# EasyEDA Pro project MainPCB.epro

# Schematic Line_Follower
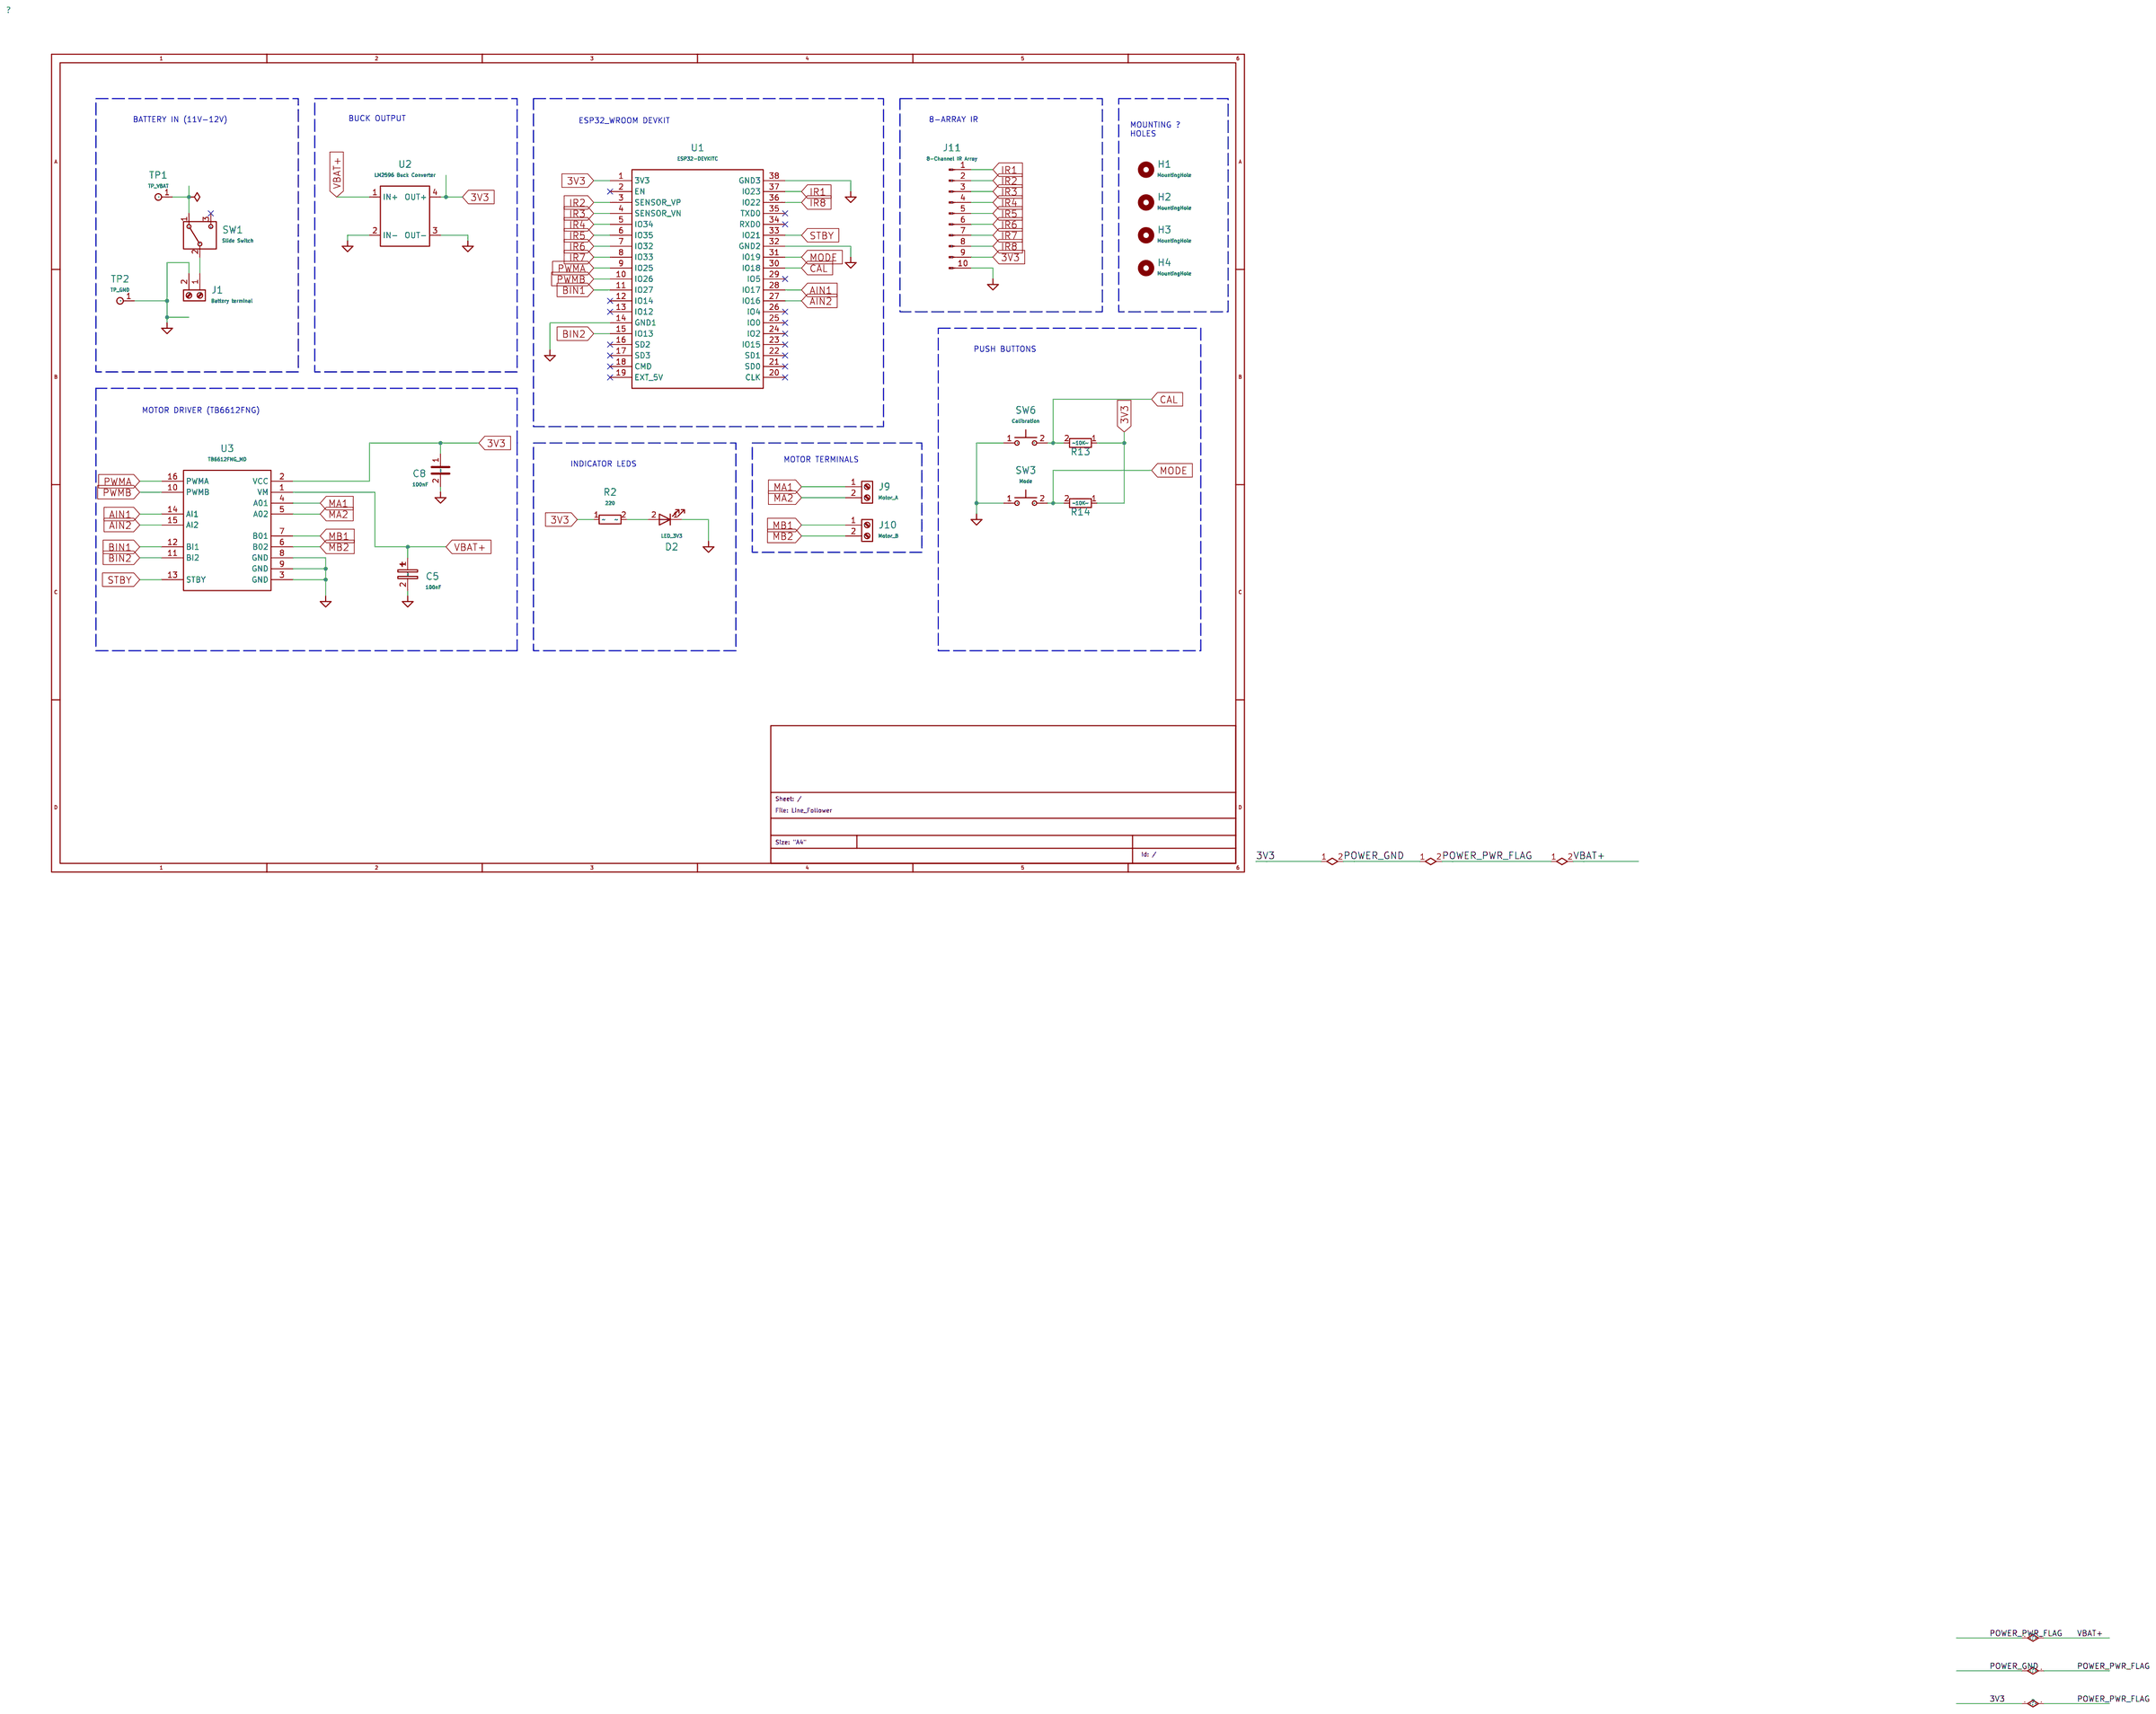
[diagram p0: schematic sheet]

## Parts
C5  100nF  [Capacitors:C320C]
C8  100nF  [Capacitors:C320C]
D2  LED_3V3  [LED_THT:LED_D5.0mm]
H1  MountingHole  [MountingHole:MountingHole_3.2mm_M3]
H2  MountingHole  [MountingHole:MountingHole_3.2mm_M3]
H3  MountingHole  [MountingHole:MountingHole_3.2mm_M3]
H4  MountingHole  [MountingHole:MountingHole_3.2mm_M3]
J1  Battery terminal  [Screw Terminal:CUI_TB007-508-02BE]
J9  Motor_A  [Screw Terminal:CUI_TB007-508-02BE]
J10  Motor_B  [Screw Terminal:CUI_TB007-508-02BE]
J11  8-Channel IR Array  [Connector_PinHeader_2.54mm:PinHeader_1x10_P2.54mm_Vertical]
R2  220  [Resistor_THT:R_Axial_DIN0207_L6.3mm_D2.5mm_P10.16mm_Horizontal]
R13  10K  [Resistor_THT:R_Axial_DIN0207_L6.3mm_D2.5mm_P10.16mm_Horizontal]
R14  10K  [Resistor_THT:R_Axial_DIN0207_L6.3mm_D2.5mm_P10.16mm_Horizontal]
SW1  Slide Switch  [Button_Switch_THT:SW_Slide-03_Wuerth-WS-SLTV_10x2.5x6.4_P2.54mm]
SW3  Mode  [Button_Switch_THT:SW_PUSH_6mm]
SW6  Calibration  [Button_Switch_THT:SW_PUSH_6mm]
TP1  TP_VBAT  [TestPoint:TestPoint_Pad_2.0x2.0mm]
TP2  TP_GND  [TestPoint:TestPoint_Pad_2.0x2.0mm]
U1  ESP32-DEVKITC  [ESP-WROOM:MODULE_ESP32-DEVKITC]
U2  LM2596 Buck Converter  [Buck_Converter:LM2596_Buck_Module]
U3  TB6612FNG_MD  [TB6612FNG:TB6612FNG_Driver]

## Library data of the parts
C5 = Device_C_Polarized: Polarized capacitor
C8 = Device_C: Unpolarized capacitor
D2 = Device_LED: Light emitting diode; Sim_Pins: 1=K 2=A; Sim.Pins: 1=K 2=A
H1-H3 = Mechanical_MountingHole: Mounting Hole without connection; Attribute1: H4
H4 = Mechanical_MountingHole: Mounting Hole without connection
J1 J9 J10 = Connector_Screw_Terminal_01x02: Generic screw terminal, single row, 01x02, script generated (kicad-library-utils/schlib/autogen/connector/)
J11 = Connector_Conn_01x10_Pin: Generic connector, single row, 01x10, script generated
R2 R13 = Device_R: Resistor; Attribute1: R14
R14 = Device_R: Resistor
SW1 = Switch_SW_SPDT: Switch, single pole double throw
SW3 = Switch_SW_Push: Push button switch, generic, two pins
SW6 = Switch_SW_Push: Push button switch, generic, two pins; Attribute1: SW3
TP1 = Connector_TestPoint: test point; Attribute1: TP2
TP2 = Connector_TestPoint: test point
U1 = ESP32-DEVKITC_ESP32-DEVKITC: MF: Espressif Systems; Description_1: Transceiver; 802.11 b/g/n (Wi-Fi, WiFi, WLAN), Bluetooth- Smart Ready 4.x Dual Mode; Package1: None; Price: None; Check_prices: https://www.snapeda.com/parts/ESP32-DEVKITC-32D-F/Espressif+Systems/view-part/?ref=eda; STANDARD: Manufacturer Recommendations; PARTREV: N/A; SnapEDA_Link: https://www.snapeda.com/parts/ESP32-DEVKITC-32D-F/Espressif+Systems/view-part/?ref=snap; MP: ESP32-DEVKITC-32D-F; Availability: In Stock; MANUFACTURER: ESPRESSIF
U2 = buck_converter_LM2596_Module
U3 = TB6612FNG_TB6612FNG_MD

## Nets
AIN1: U1.28(IO17) U3.14(AI1)
AIN2: U1.27(IO16) U3.15(AI2)
BIN1: U1.11(IO27) U3.12(BI1)
BIN2: U1.15(IO13) U3.11(BI2)
CAL: R13.2 SW6.2 U1.30(IO18)
IR1: J11.1(Pin) U1.37(IO23)
IR2: J11.2(Pin) U1.3(SENSOR_VP)
IR3: J11.3(Pin) U1.4(SENSOR_VN)
IR4: J11.4(Pin) U1.5(IO34)
IR5: J11.5(Pin) U1.6(IO35)
IR6: J11.6(Pin) U1.7(IO32)
IR7: J11.7(Pin) U1.8(IO33)
IR8: J11.8(Pin) U1.36(IO22)
MA1: J9.1(Pin) U3.4(A01)
MA2: J9.2(Pin) U3.5(A02)
MB1: J10.1(Pin) U3.7(B01)
MB2: J10.2(Pin) U3.6(B02)
MODE: R14.2 SW3.2 U1.31(IO19)
POWER_GND: C5.1 C5.2 C8.1 C8.2 D2.1(K) J1.2(Pin) J11.9(Pin) J11.10(Pin) R2.1 R13.1 R14.1 SW1.1(A) SW3.1 SW6.1 TP1.1 TP2.1 U1.1(3V3) U1.14(GND1) U1.32(GND2) U1.38(GND3) U2.1(IN+) U2.2(IN-) U2.3(OUT-) U2.4(OUT+) U3.1(VM) U3.2(VCC) U3.3(GND) U3.8(GND) U3.9(GND)
PWMA: U1.9(IO25) U3.16(PWMA)
PWMB: U1.10(IO26) U3.10(PWMB)
STBY: U1.33(IO21) U3.13(STBY)
NET-(D2-A): D2.2(A) R2.2
NET-(J1-PIN_1): J1.1(Pin) SW1.2(B)

Not connected (* = marked no-connect by the designer): SW1 3(C)*; U1 2(EN)* 12(IO14)* 13(IO12)* 16(SD2)* 17(SD3)* 18(CMD)* 19(EXT_5V)* 20(CLK)* 21(SD0)* 22(SD1)* 23(IO15)* 24(IO2)* 25(IO0)* 26(IO4)* 29(IO5)* 34(RXD0)* 35(TXD0)*

## Notes on the sheet
- BATTERY IN (11V-12V)
- BUCK OUTPUT
- ESP32_WROOM DEVKIT
- 8-ARRAY IR
- MOUNTING
  HOLES
- PUSH BUTTONS
- MOTOR DRIVER (TB6612FNG)
- MOTOR TERMINALS
- INDICATOR LEDS

# Board Line_Follower
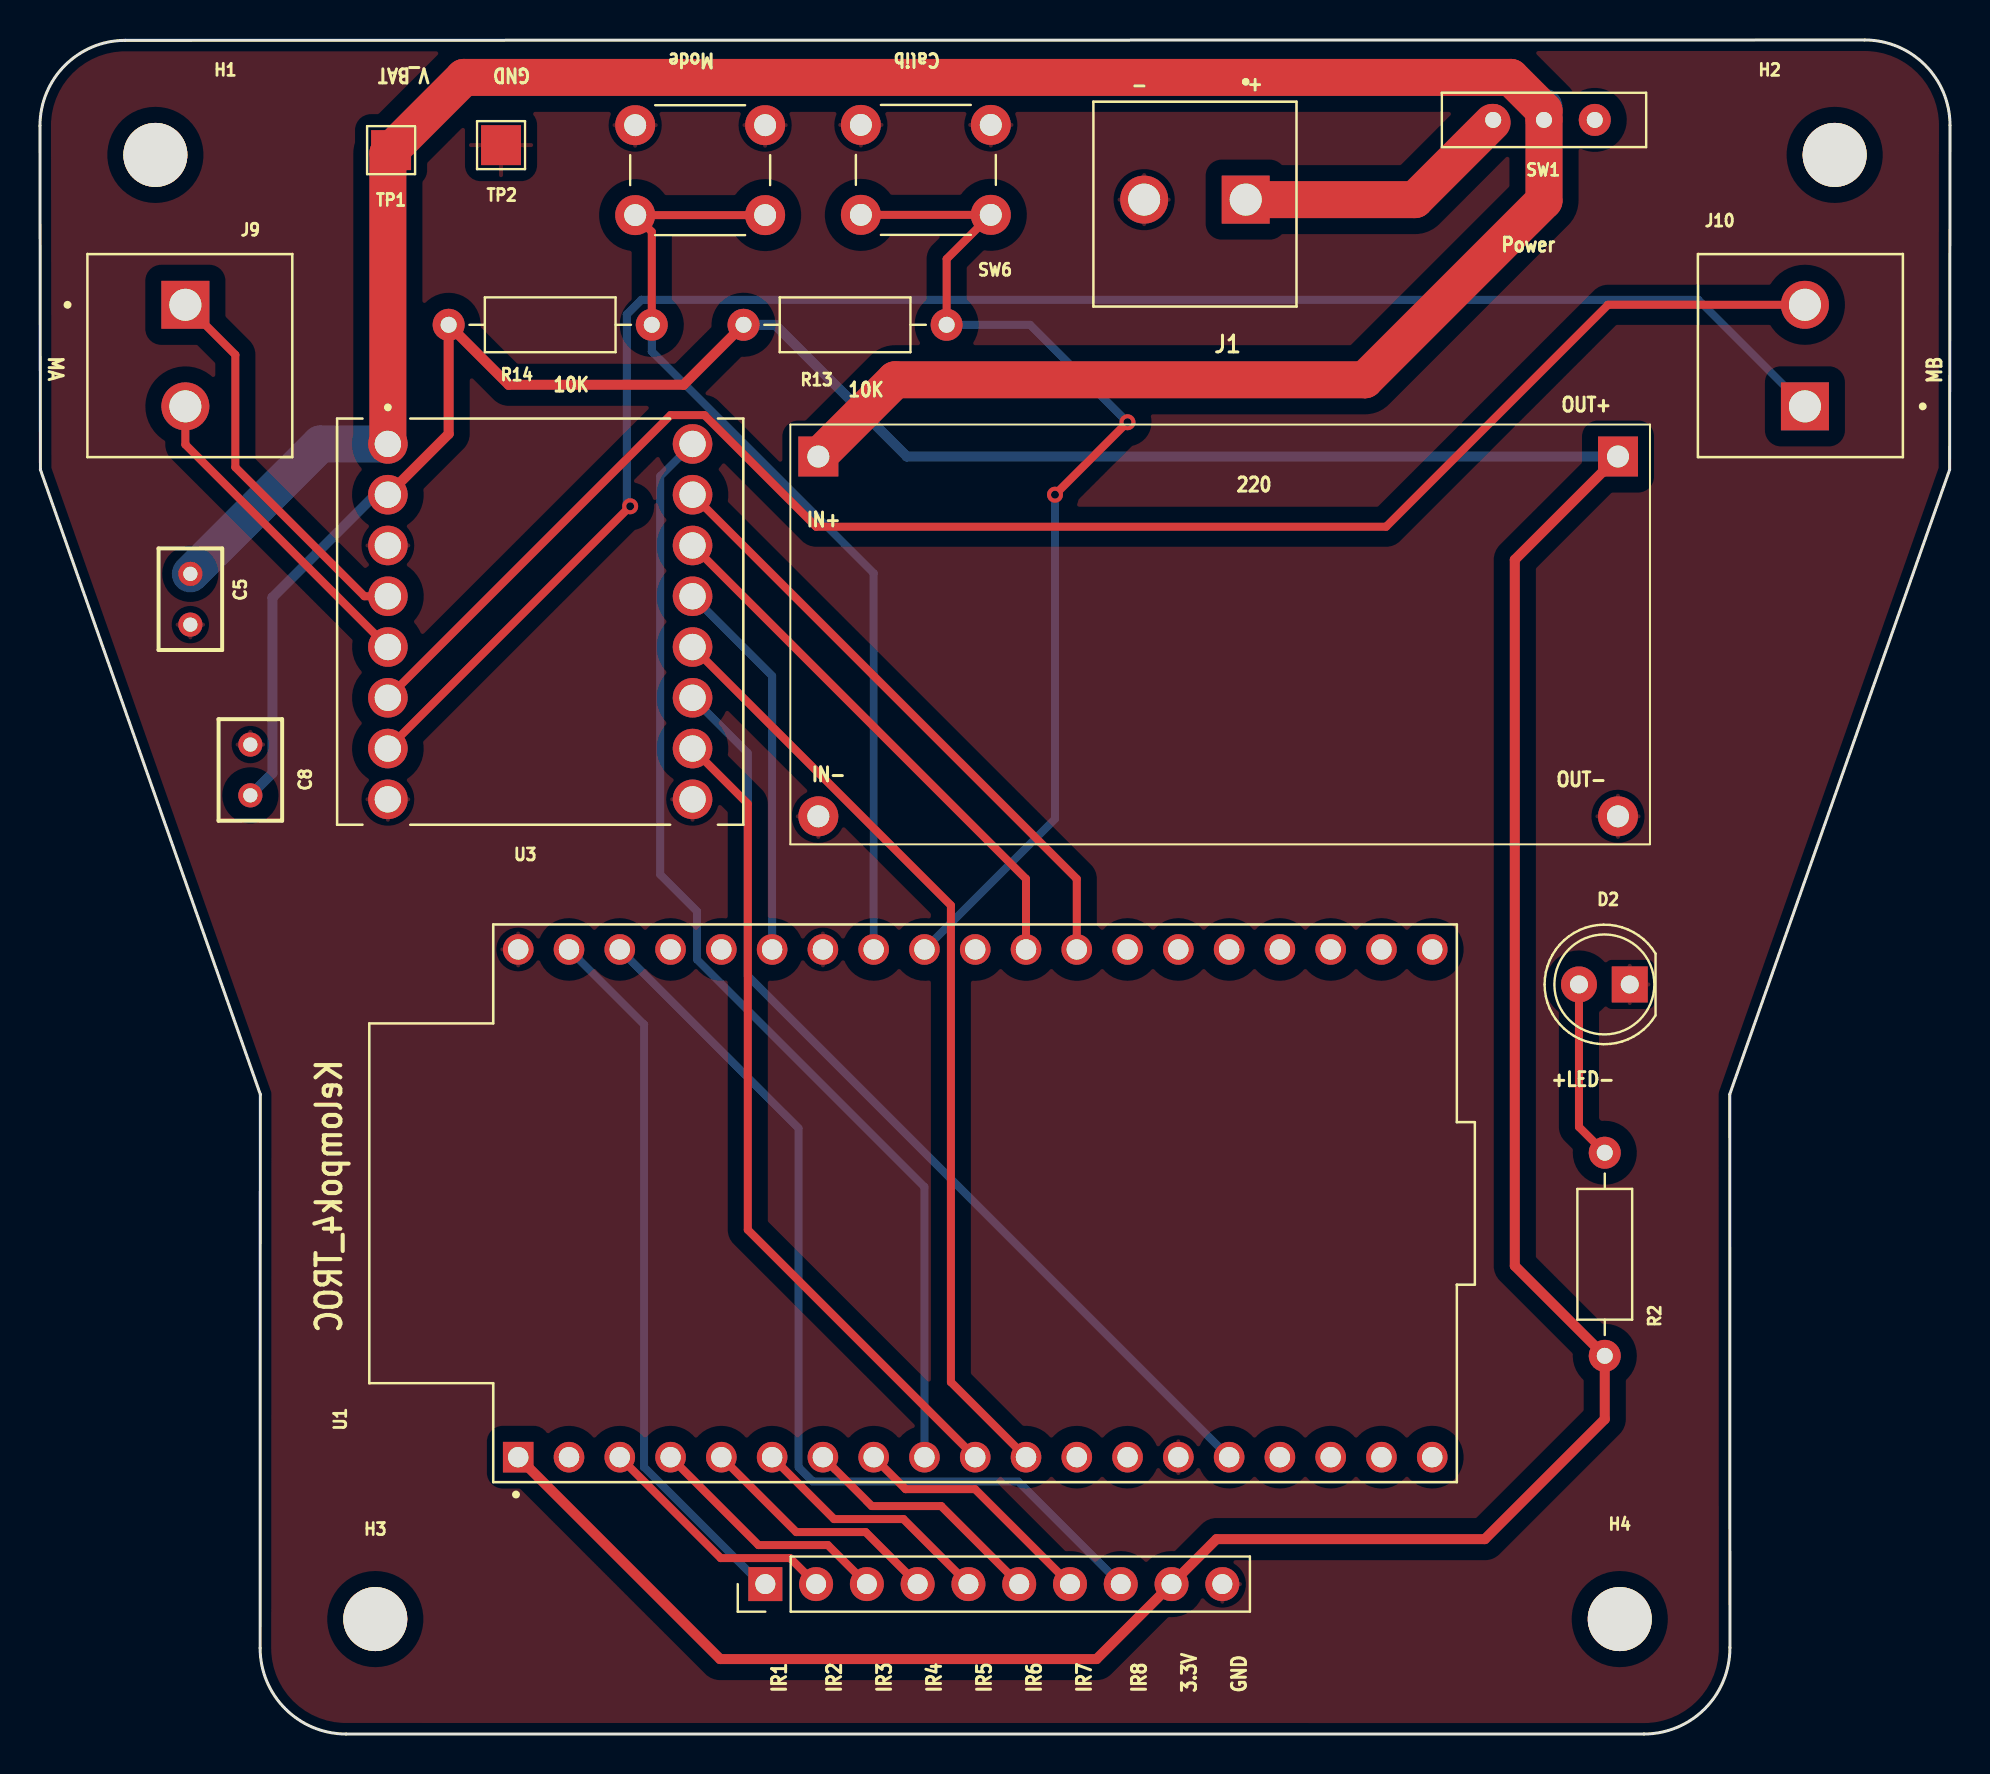
[diagram p1: board, top side]
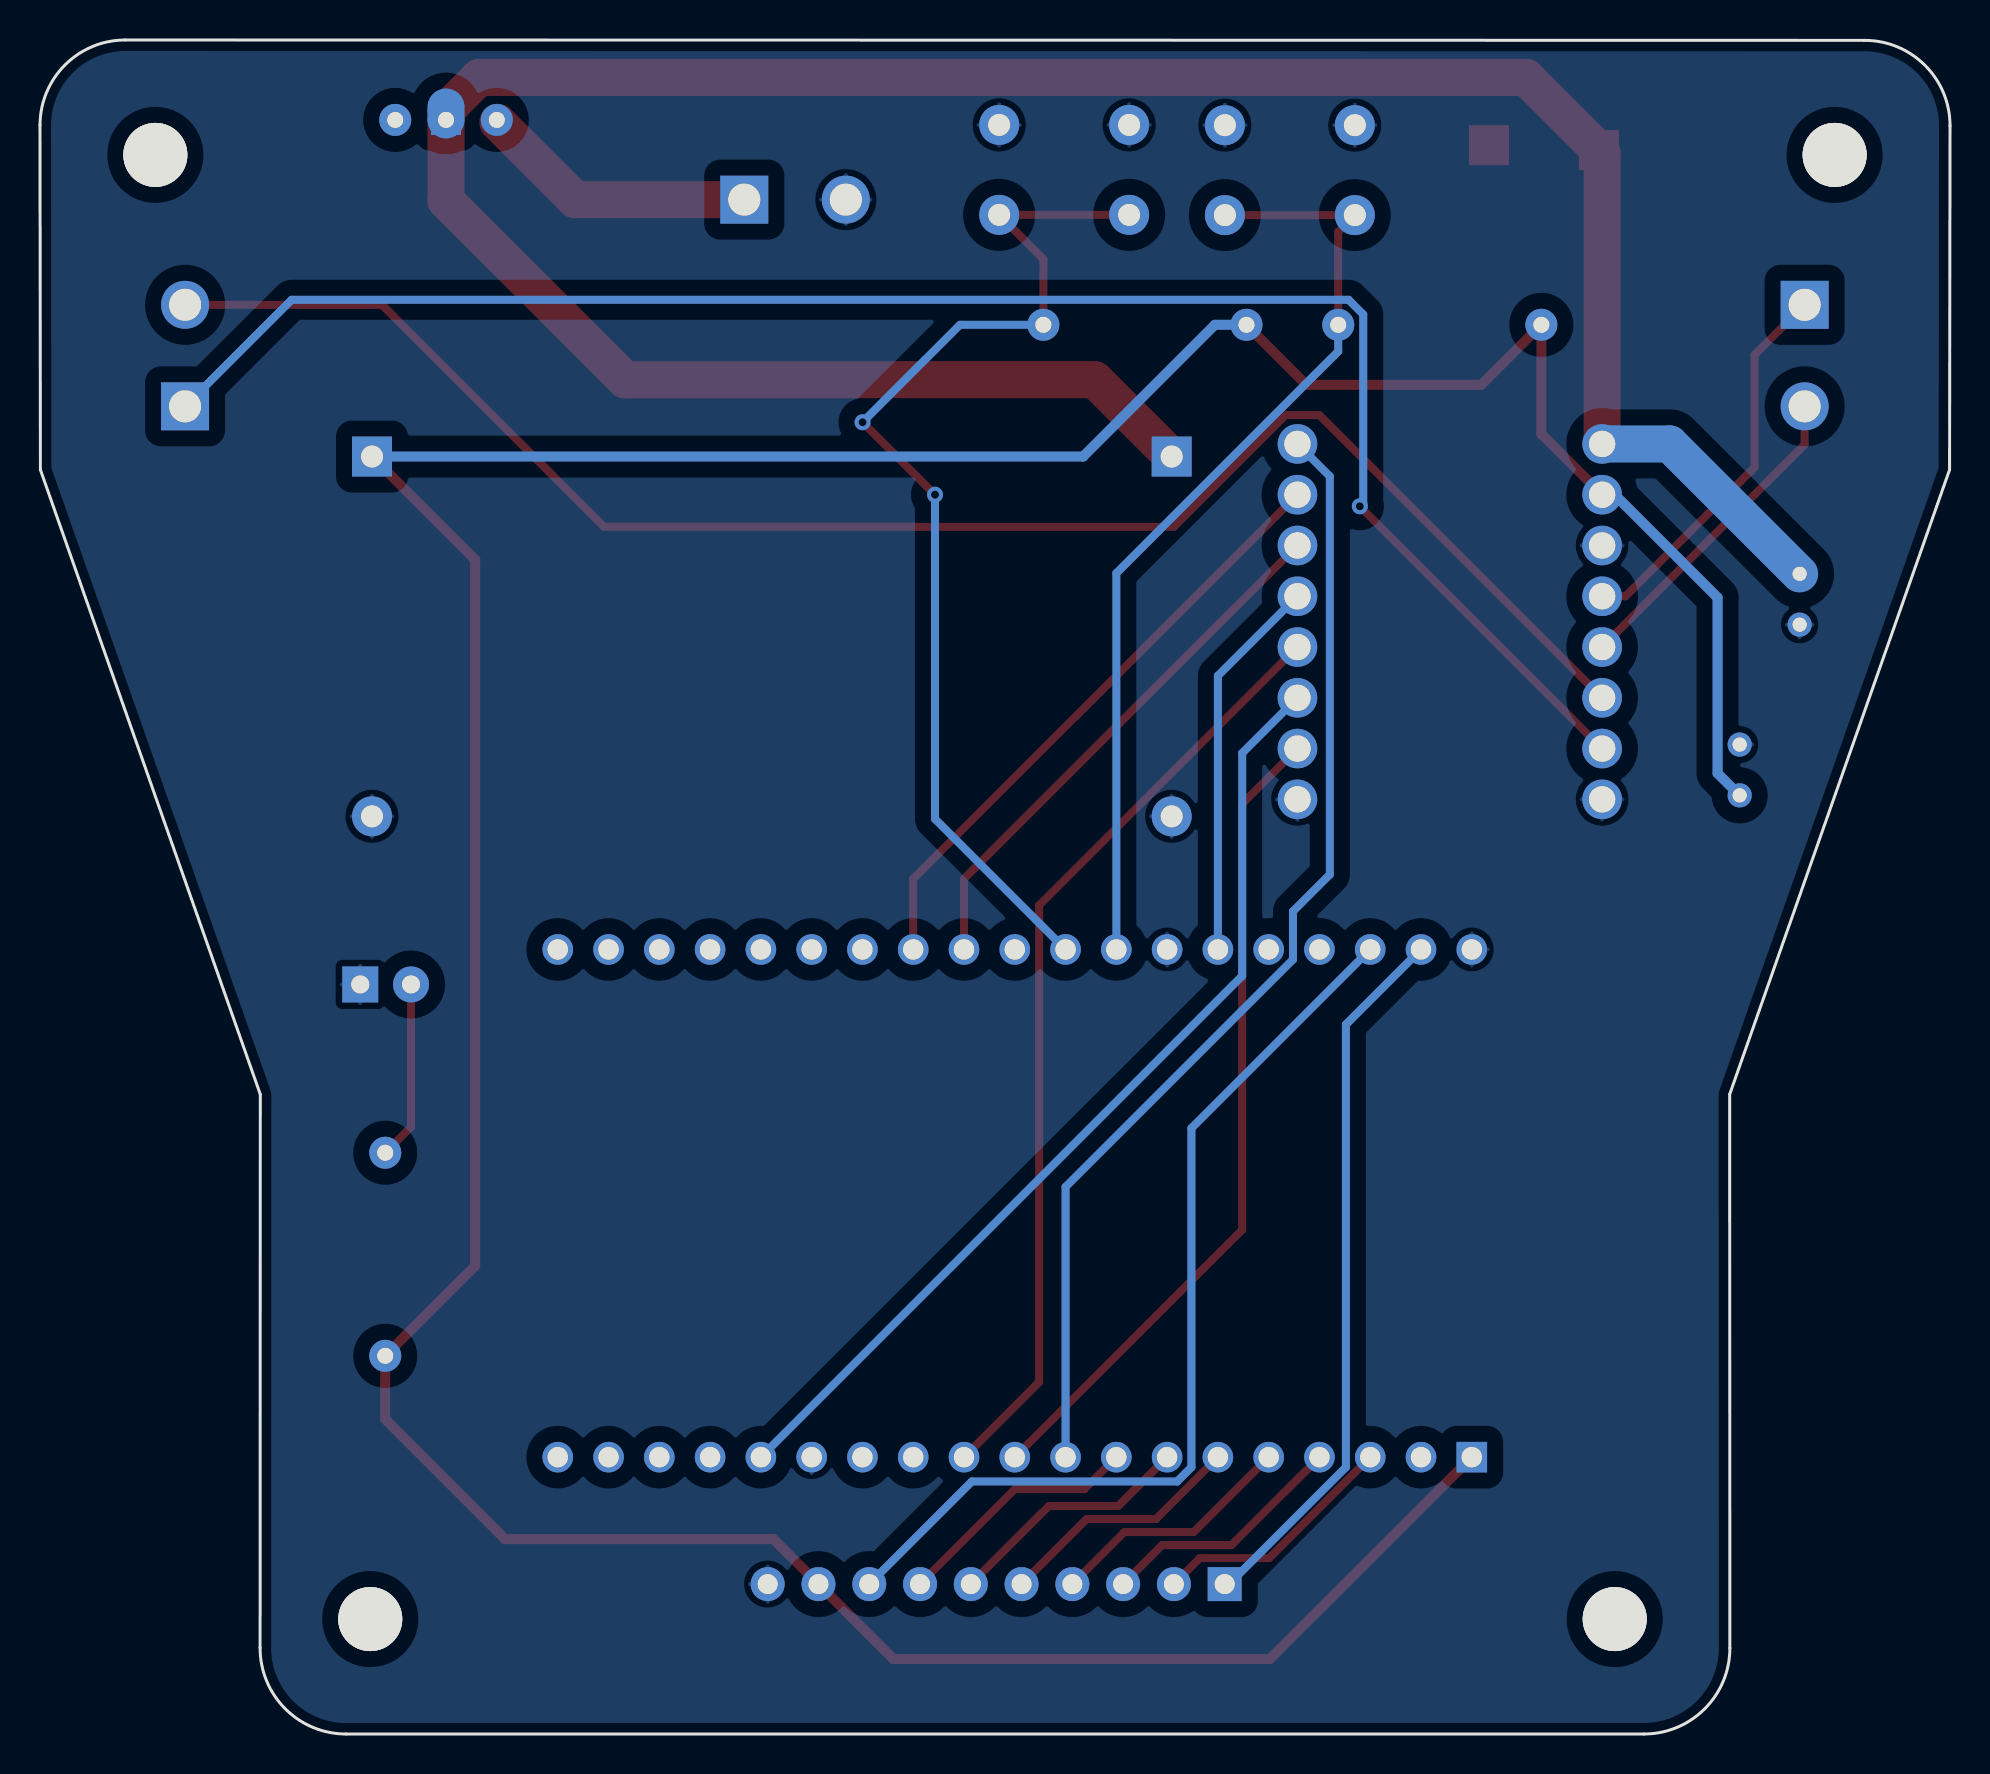
[diagram p2: board, bottom side, seen from below]

Outline 95.54 x 84.75 mm; copper layers: Top Layer, Bottom Layer. Coordinates in mm from the lower left corner of the outline.
Outline path: 0,80.46 0.02,63.25 11.02,32 11.01,4.3 arc(12.27,1.26) 15.31,0 80.23,0 arc(83.28,1.27) 84.53,4.32 84.52,32 95.52,63.25 95.54,80.48 arc(94.29,83.5) 91.27,84.75 4.27,84.73 arc(1.25,83.48) 0,80.46
Stack: Top Layer 0.0009mm / dielectric 1 0.0384mm FR4 er 4.5 / Bottom Layer 0.0009mm

## Design rules (mm)
spacing safeClearance (default): track to track 0.2, other pairs 0.2 to 0.5
spacing Plane_innerPlane: track to track 0.2, other pairs 0.2 to 0.5
spacing Copper_CopperRegion: track to track 0.2, other pairs 0.2 to 0.5
spacing Copper_CopperRegion1: track to track 0.2, other pairs 0.2 to 0.5
track width trackWidth (default): min 0.127, default 0.254, max 2.54
differential pair differentialPair (default): width min 0.127, default 0.254, max 2.54; gap min 0.152, default 0.152
net GND uses CopperRegion1_safeClearance
pour e136 uses CopperRegion, Copper_CopperRegion1
pour e193 uses CopperRegion1_Copper_CopperRegion1, Copper_CopperRegion1

## Placement (name value [footprint] x y rotation side)
C5  100nF  [Capacitors:C320C]  14.52 49.77 270 top
C8  100nF  [Capacitors:C320C]  3.52 55.23 90 top
D2  LED_3V3  [LED_THT:LED_D5.0mm]  79.52 37.5 180 top
H1  MountingHole  [MountingHole:MountingHole_3.2mm_M3]  5.77 79 0 top
H2  MountingHole  [MountingHole:MountingHole_3.2mm_M3]  89.77 79 0 top
H3  MountingHole  [MountingHole:MountingHole_3.2mm_M3]  16.77 5.75 0 top
H4  MountingHole  [MountingHole:MountingHole_3.2mm_M3]  79.02 5.75 0 top
J1  Battery terminal  [Screw Terminal:CUI_TB007-508-02BE]  60.31 76.76 180 top
J9  Motor_A  [Screw Terminal:CUI_TB007-508-02BE]  7.27 71.5 270 top
J10  Motor_B  [Screw Terminal:CUI_TB007-508-02BE]  88.28 66.42 90 top
J11  8-Channel IR Array  [Connector_PinHeader_2.54mm:PinHeader_1x10_P2.54mm_Vertical]  36.28 7.5 90 top
R2  220  [Resistor_THT:R_Axial_DIN0207_L6.3mm_D2.5mm_P10.16mm_Horizontal]  78.27 18.92 90 top
R13  10K  [Resistor_THT:R_Axial_DIN0207_L6.3mm_D2.5mm_P10.16mm_Horizontal]  35.19 70.5 0 top
R14  10K  [Resistor_THT:R_Axial_DIN0207_L6.3mm_D2.5mm_P10.16mm_Horizontal]  20.44 70.5 0 top
SW1  Slide Switch  [Button_Switch_THT:SW_Slide-03_Wuerth-WS-SLTV_10x2.5x6.4_P2.54mm]  75.23 80.75 0 top
SW3  Mode  [Button_Switch_THT:SW_PUSH_6mm]  29.77 80.49 0 top
SW6  Calibration  [Button_Switch_THT:SW_PUSH_6mm]  41.06 80.5 0 top
TP1  TP_VBAT  [TestPoint:TestPoint_Pad_2.0x2.0mm]  17.56 79.24 180 top
TP2  TP_GND  [TestPoint:TestPoint_Pad_2.0x2.0mm]  23.06 79.49 0 top
U1  ESP32-DEVKITC  [ESP-WROOM:MODULE_ESP32-DEVKITC]  46.77 26.55 90 top
U2  LM2596 Buck Converter  [Buck_Converter:LM2596_Buck_Module]  37.53 44.51 0 top
U3  TB6612FNG_MD  [TB6612FNG:TB6612FNG_Driver]  25.02 55.65 0 top

## Footprints (pads in the part's own frame, mm; a bottom-side part is the same pattern mirrored in y, then rotated)
Buck_Converter:LM2596_Buck_Module
  rect 2x2 hole 1.1: 1(1.4,19.4) 4(41.4,19.4)
  round 2 hole 1.1: 2(1.4,1.4) 3(41.4,1.4)
Button_Switch_THT:SW_PUSH_6mm
  round 2 hole 1.1: 1(0,0) 1(6.5,0) 2(0,-4.5) 2(6.5,-4.5)
Button_Switch_THT:SW_Slide-03_Wuerth-WS-SLTV_10x2.5x6.4_P2.54mm
  rect 1.5x1.5 hole 0.8: 1(0,0)
  round 1.6 hole 0.8: 2(-2.54,0) 3(2.54,0)
Capacitors:C320C
  round 1.21 hole 0.71: 1(-8.27,-7) 2(-5.73,-7)
Connector_PinHeader_2.54mm:PinHeader_1x10_P2.54mm_Vertical
  rect 1.7x1.7 hole 1: 1(0,0)
  round 1.7 hole 1: 2(0,-2.54) 3(0,-5.08) 4(0,-7.62) 5(0,-10.16) 6(0,-12.7) 7(0,-15.24) 8(0,-17.78) 9(0,-20.32) 10(0,-22.86)
ESP-WROOM:MODULE_ESP32-DEVKITC
  rect 1.53x1.53 hole 1.02: 1(-12.7,22.85)
  round 1.53 hole 1.02: 2(-12.7,20.31) 3(-12.7,17.77) 4(-12.7,15.23) 5(-12.7,12.69) 6(-12.7,10.15) 7(-12.7,7.61) 8(-12.7,5.07) 9(-12.7,2.53) 10(-12.7,-0.01) 11(-12.7,-2.55) 12(-12.7,-5.09) 13(-12.7,-7.63) 14(-12.7,-10.17) 15(-12.7,-12.71) 16(-12.7,-15.25) 17(-12.7,-17.79) 18(-12.7,-20.33) 19(-12.7,-22.87) 20(12.7,-22.87) 21(12.7,-20.33) 22(12.7,-17.79) 23(12.7,-15.25) 24(12.7,-12.71) 25(12.7,-10.17) 26(12.7,-7.63) 27(12.7,-5.09) 28(12.7,-2.55) 29(12.7,-0.01) 30(12.7,2.53) 31(12.7,5.07) 32(12.7,7.61) 33(12.7,10.15) 34(12.7,12.69) 35(12.7,15.23) 36(12.7,17.77) 37(12.7,20.31) 38(12.7,22.85)
LED_THT:LED_D5.0mm
  rect 1.8x1.8 hole 0.9: 1(0,0)
  round 1.8 hole 0.9: 2(2.54,0)
MountingHole:MountingHole_3.2mm_M3
  round 3.2 hole 3.2: (0,0)
Resistor_THT:R_Axial_DIN0207_L6.3mm_D2.5mm_P10.16mm_Horizontal
  round 1.6 hole 0.8: 1(0,0) 2(10.16,0)
Screw Terminal:CUI_TB007-508-02BE
  rect 2.4x2.4 hole 1.6: 1(0,0)
  round 2.4 hole 1.6: 2(5.08,0)
TB6612FNG:TB6612FNG_Driver
  round 1.98 hole 1.32: 1(-7.62,8.89) 2(-7.62,6.35) 3(-7.62,3.81) 4(-7.62,1.27) 5(-7.62,-1.27) 6(-7.62,-3.81) 7(-7.62,-6.35) 8(-7.62,-8.89) 9(7.62,-8.89) 10(7.62,-6.35) 11(7.62,-3.81) 12(7.62,-1.27) 13(7.62,1.27) 14(7.62,3.81) 15(7.62,6.35) 16(7.62,8.89)
TestPoint:TestPoint_Pad_2.0x2.0mm
  rect 2x2 smd: 1(0,0)

## Nets
As in the schematic, except:
3V3: C8.1 J11.9 R2.1 R13.1 R14.1 U1.1 U2.4 U3.2
GND: C5.2 C8.2 D2.1 J1.2 J11.10 SW3.1 SW6.1 TP2.1 U1.14 U1.32 U1.38 U2.2 U2.3 U3.3 U3.8 U3.9
VBAT+: C5.1 SW1.1 TP1.1 U2.1 U3.1

## Via types
v1: diameter 0.8, hole 0.4, Top Layer to Bottom Layer, 3 vias

## Routing (per net, layer and track width the routed paths; a pad name or vN(x,y) marks a point on that pad's centre or on a via; arc(x,y) is an arc through that point)
3V3: length 207.4
  Top Layer w0.5: U3.2 20.44,65.04 R14.1 23.44,67.5 32.19,67.5 R13.1 ; U2.4 73.77,58.75 73.77,23.42 R2.1 78.27,15.75 72.27,9.75 58.85,9.75 J11.9 52.85,3.75 34.02,3.75 U1.1
  Bottom Layer w0.5: U2.4 43.36,63.91 36.77,70.5 R13.1 ; C8.1 11.63,48.07 11.63,56.86 16.77,62 U3.2
GND: length 0
  Top Layer w0.4: 41.05,80.49 SW6.1
VBAT+: length 134
  Top Layer w1.85: U2.1 42.77,67.75 66.27,67.75 75.23,76.71 SW1.1 75.23,81.22 73.57,82.88 21.2,82.88 TP1.1 17.4,79.08 U3.1
  Bottom Layer w1.85: C5.1 14.02,64.54 U3.1 ; SW1.1 75.23,81.39
AIN1: length 27.1
  Top Layer w0.4: U1.28 49.32,42.78 U3.14
AIN2: length 30.7
  Top Layer w0.4: U1.27 51.86,42.78 U3.15
BIN1: length 47.4
  Top Layer w0.4: U1.11 45.57,17.61 45.57,41.46 U3.12
BIN2: length 49.1
  Bottom Layer w0.4: U1.15 35.41,37.93 35.41,49.08 U3.11
CAL: length 54.6
  Top Layer w0.4: R13.2 45.35,73.79 SW6.2 SW6.2 ; v1(50.77,62) v1(54.4,65.62)
  Bottom Layer w0.4: v1(54.4,65.62) 49.52,70.5 R13.2 ; U1.30 50.77,45.78 v1(50.77,62)
IR1: length 35.9
  Bottom Layer w0.4: J11.1 36.06,7.5 30.22,13.35 30.22,35.49 U1.37
IR2: length 12.5
  Top Layer w0.4: J11.2 37.52,8.8 34.05,8.8 U1.3
IR3: length 12.5
  Top Layer w0.4: J11.3 39.41,9.45 35.94,9.45 U1.4
IR4: length 12.5
  Top Layer w0.4: J11.4 41.3,10.1 37.83,10.1 U1.5
IR5: length 12.5
  Top Layer w0.4: U1.6 39.72,10.75 43.19,10.75 J11.5
IR6: length 12.5
  Top Layer w0.4: J11.6 45.08,11.41 41.61,11.41 U1.7
IR7: length 12.5
  Top Layer w0.4: J11.7 46.77,12.25 43.3,12.25 U1.8
IR8: length 48.1
  Bottom Layer w0.4: J11.8 48.93,12.63 38.66,12.63 37.95,13.35 37.95,30.31 U1.36
MA1: length 19.5
  Top Layer w0.4: J9.1 9.77,69 9.77,63.38 16.23,56.92 U3.4
MA2: length 16.2
  Top Layer w0.4: U3.5 7.27,64.51 J9.2
MB1: length 88.3
  Top Layer w0.4: U3.7 v1(29.52,61.42)
  Bottom Layer w0.4: J10.1 82.95,71.75 30.08,71.75 29.35,71.02 29.35,61.59 v1(29.52,61.42)
MB2: length 83.7
  Top Layer w0.4: U3.6 31.54,65.98 33.24,65.98 38.82,60.4 67.33,60.4 78.44,71.5 J10.2
MODE: length 48.2
  Top Layer w0.4: SW3.2 SW3.2 30.6,75.16 R14.2
  Bottom Layer w0.4: R14.2 30.6,69.17 41.7,58.07 U1.31
NET-(D2-A): length 9
  Top Layer w0.4: R2.2 76.98,30.37 D2.2
NET-(J1-PIN_1): length 13.9
  Top Layer w1.85: 72.64,80.62 68.78,76.76 J1.1
PWMA: length 56.8
  Bottom Layer w0.4: U3.16 31.02,62.92 31.02,43 32.87,41.16 32.87,38.75 44.24,27.37 U1.9
PWMB: length 41.3
  Top Layer w0.4: U1.10 35.41,25.23 35.41,46.54 U3.10
STBY: length 19.3
  Bottom Layer w0.4: U3.13 36.62,52.94 U1.33

## Copper pours and planes (outline as drawn; the poured copper is in the pictures)
GND on Top Layer: -1.48,86 97.27,86.5 97.02,61.75 86.27,31.5 86.02,-1.75 9.52,-1.5 9.77,30.75 -1.48,62.5
GND on Bottom Layer: -1.48,86 97.27,86.5 97.02,61.75 86.27,31.5 86.02,-1.75 9.52,-1.5 9.77,30.75 -1.48,62.5

## Text on the board
Top Silkscreen Layer: - | + | Calib | 10K | 220 | Power | IR1 | IR2 | IR3 | IR4 | IR5 | IR6 | IR7 | IR8 | 3.3V | GND | MB | V_BAT | Mode | MA | IN+ | IN- | +LED- | OUT- | OUT+ | Kelompok4_TROC
